# EAGLE design Brunei_Brain (EAGLE 6.5.0)
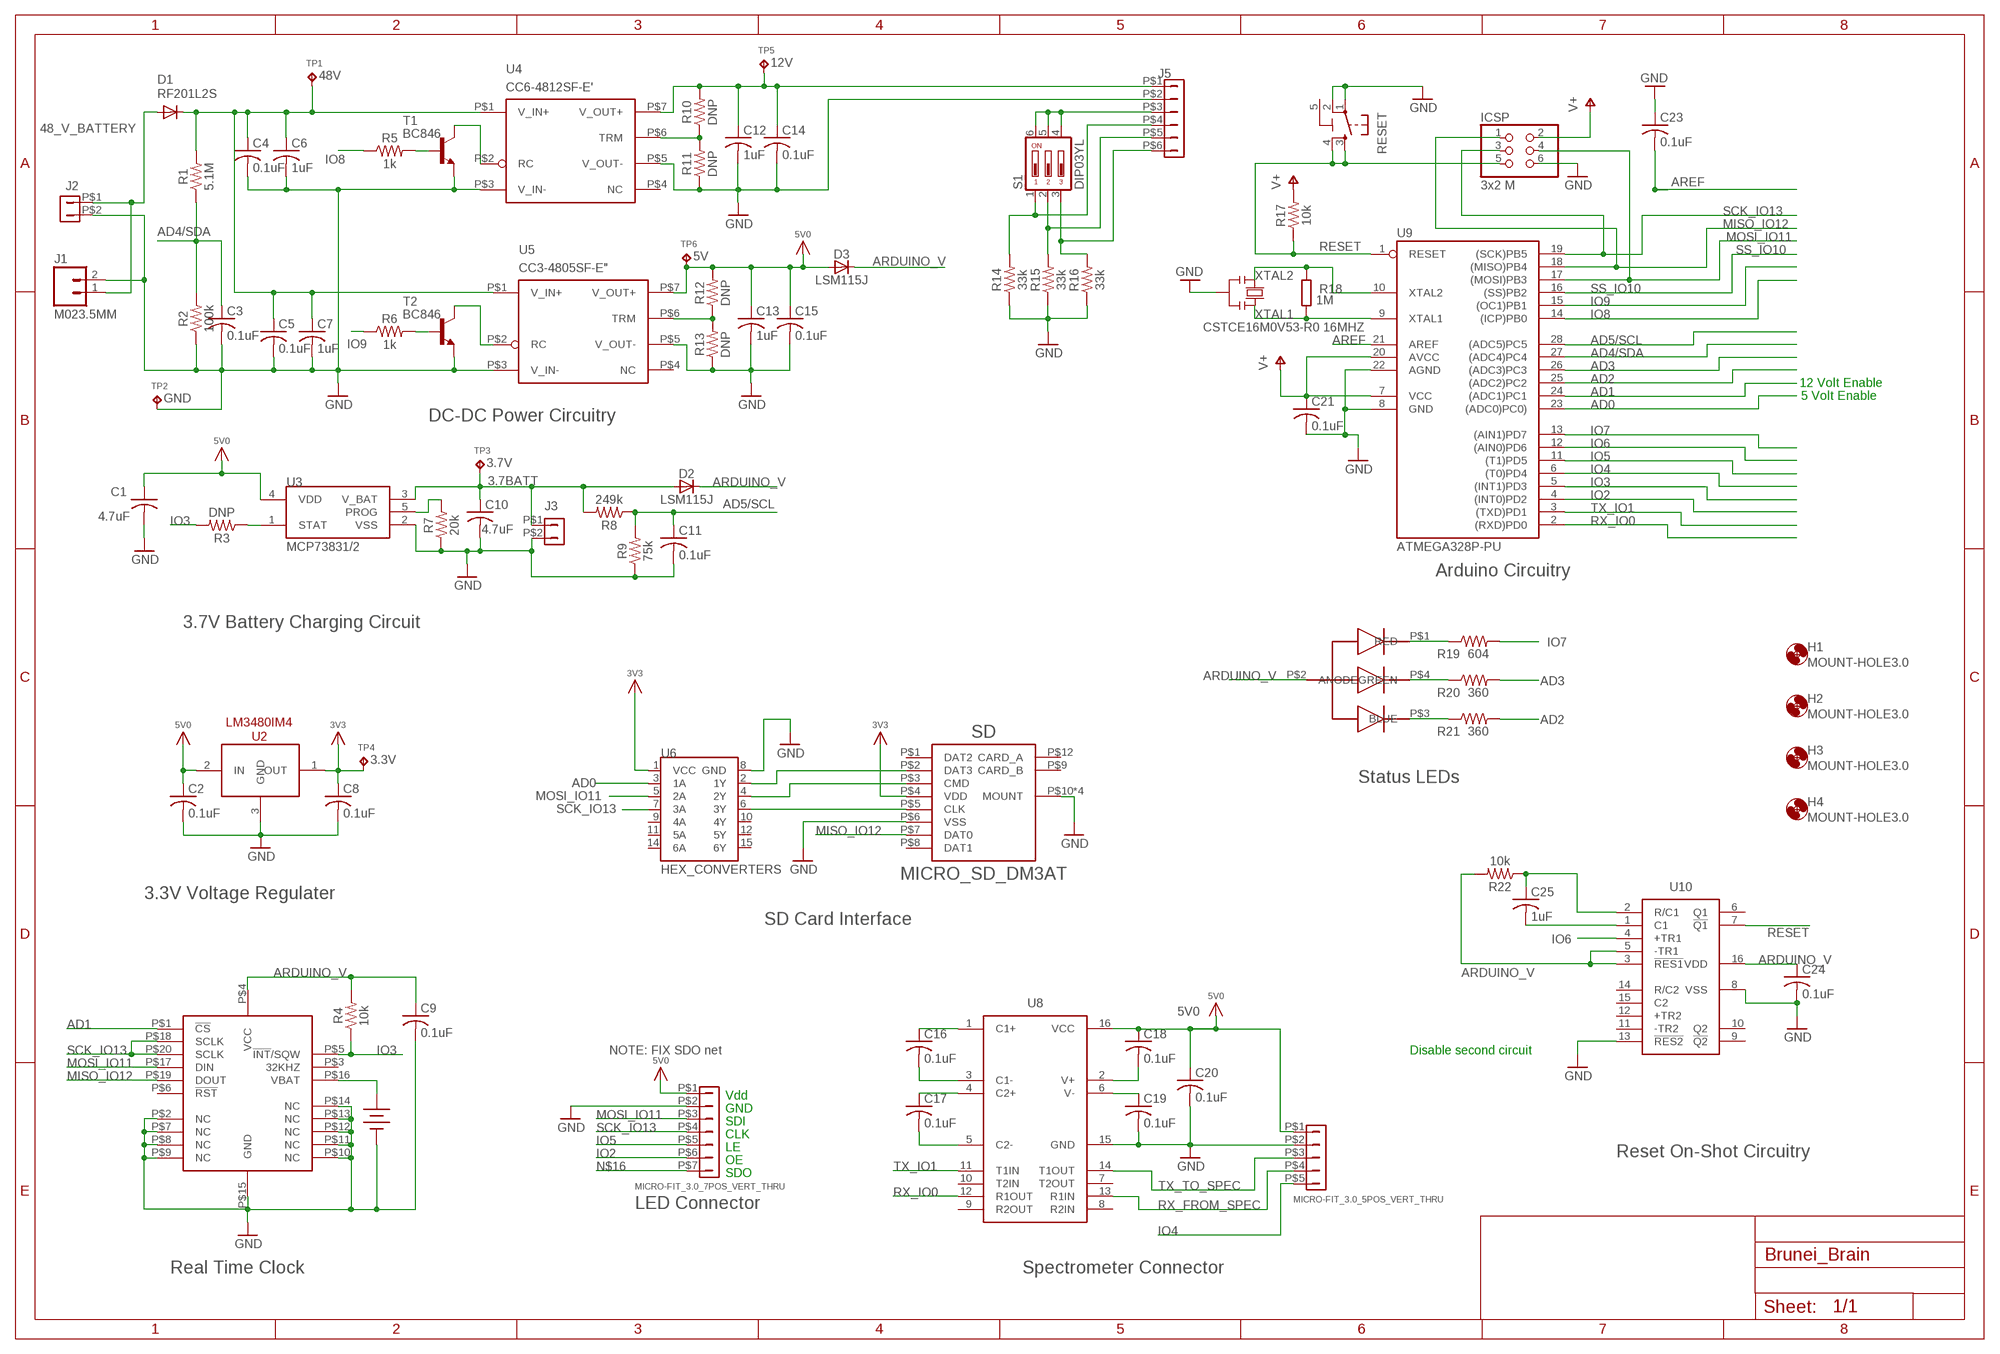
[diagram p0: schematic, sheet 1]

## Parts
B1  BATTERY_12MM  [KEYSTONE_12MM_BATT_SM]
C1  4.7uF  C-USC0603  [C0603]
C2  0.1uF  C-USC0603  [C0603]
C3  0.1uF  C-USC0603  [C0603]
C4  0.1uF  C-USC0603  [C0603]
C5  0.1uF  C-USC0603  [C0603]
C6  1uF  C-USC1206  [C1206]
C7  1uF  C-USC1206  [C1206]
C8  0.1uF  C-USC0603  [C0603]
C9  0.1uF  C-USC0603  [C0603]
C10  4.7uF  C-USC0603  [C0603]
C11  0.1uF  C-USC0603  [C0603]
C12  1uF  C-USC1206  [C1206]
C13  1uF  C-USC1206  [C1206]
C14  0.1uF  C-USC0603  [C0603]
C15  0.1uF  C-USC0603  [C0603]
C16  0.1uF  C-USC0603  [C0603]
C17  0.1uF  C-USC0603  [C0603]
C18  0.1uF  C-USC0603  [C0603]
C19  0.1uF  C-USC0603  [C0603]
C20  0.1uF  C-USC0603  [C0603]
C21  0.1uF  C-USC0603  [C0603]
C23  0.1uF  C-USC0603  [C0603]
C24  0.1uF  C-USC0603  [C0603]
C25  1uF  C-USC1206  [C1206]
D1  RF201L2S  RF201L2SRF201L2S  [SOD-106]
D2  LSM115J  LSM115JLSM115J  [DO-214BA]
D3  LSM115J  LSM115JLSM115J  [DO-214BA]
D4  RGB_LED_COMMON_ANODE_1  [PLCC-4]
H1  MOUNT-HOLE3.0  [3,0]
H2  MOUNT-HOLE3.0  [3,0]
H3  MOUNT-HOLE3.0  [3,0]
H4  MOUNT-HOLE3.0  [3,0]
ICSP  3x2 M  PINHD-2X3  [2X03]
J1  M023.5MM  [SCREWTERMINAL-3.5MM-2]
J2  MICRO-FIT_3.0_2POS_VERT_THRU  [MICRO-FIT_3.0_2POS_VERT_THROUGH]
J3  MICRO-FIT_3.0_2POS_VERT_THRU  [MICRO-FIT_3.0_2POS_VERT_THROUGH]
J4  MICRO-FIT_3.0_7POS_VERT_THRU  [MICRO-FIT_3.0_7POS_VERT_THROUGH]
J5  MICRO-FIT_3.0_6POS_VERT_THRU  [MICRO-FIT_3.0_6POS_VERT_THROUGH]
J6  MICRO-FIT_3.0_5POS_VERT_THRU  [MICRO-FIT_3.0_5POS_VERT_THROUGH]
R1  5.1M  RESISTOR0603-RES  [0603-RES]
R2  100k  RESISTOR0603-RES  [0603-RES]
R3  DNP  RESISTOR0603-RES  [0603-RES]
R4  10k  RESISTOR0603-RES  [0603-RES]
R5  1k  RESISTOR0603-RES  [0603-RES]
R6  1k  RESISTOR0603-RES  [0603-RES]
R7  20k  RESISTOR0603-RES  [0603-RES]
R8  249k  RESISTOR0603-RES  [0603-RES]
R9  75k  RESISTOR0603-RES  [0603-RES]
R10  DNP  RESISTOR0603-RES  [0603-RES]
R11  DNP  RESISTOR0603-RES  [0603-RES]
R12  DNP  RESISTOR0603-RES  [0603-RES]
R13  DNP  RESISTOR0603-RES  [0603-RES]
R14  33k  RESISTOR0603-RES  [0603-RES]
R15  33k  RESISTOR0603-RES  [0603-RES]
R16  33k  RESISTOR0603-RES  [0603-RES]
R17  10k  RESISTOR0603-RES  [0603-RES]
R18  1M  R-EU_R0603  [R0603-ROUND]
R19  604  RESISTOR0603-RES  [0603-RES]
R20  360  RESISTOR0603-RES  [0603-RES]
R21  360  RESISTOR0603-RES  [0603-RES]
R22  10k  RESISTOR0603-RES  [0603-RES]
RESET  TS42031-160R-TR-7260  TS42  [TS42]
S1  DIP03YL  [DIP03YL]
SD  MICRO_SD_DM3AT  [MICROSD_DM3AT]
T1  BC846  [SOT23]
T2  BC846  [SOT23]
TP1  TPPAD1-13  [P1-13]
TP2  TPPAD1-13  [P1-13]
TP3  TPPAD1-13  [P1-13]
TP4  TPPAD1-13  [P1-13]
TP5  TPPAD1-13  [P1-13]
TP6  TPPAD1-13  [P1-13]
U1  DS3234  [SOIC-20_MAXIM]
U2  LM3480IM4  [SOT23-3]
U3  MCP73831/2  MCP73832  [SOT23-5]
U4  CC6-4812SF-E'  [CC6-XXXXXF-E]
U5  CC3-4805SF-E"  [CC3-XXXXXF-E]
U6  HEX_CONVERTERS  [SO-16_SSG]
U8  ST232  [SO-16_SSG]
U9  ATMEGA328P-PU  [DIL28-3]
U10  MULTIVIBRATOR_DUAL  [SO-16_SSG]
Y1  CSTCE16M0V53-R0 16MHZ  RESONATORMU  [RESONATOR]

## Nets
3.7BATT [power]: C10.1 D2.P$1(A) J3.P$1 R8.2 TP3.TP U3.3(V_BAT)
3V3 [power]: C8.1 SD.P$4(VDD) TP4.TP U2.1(OUT) U6.1(VCC) ; supply symbol labelled SUP_3V3
5V0: C1.1 C2.1 C13.1 C15.1 C18.1 C20.1 D3.P$1(A) J4.P$1 J6.P$1 R12.2 TP6.TP U2.2(IN) U3.4(VDD) U5.P$7(V_OUT+) U8.16(VCC) ; supply symbol labelled SUP_5V0
12V [power]: C12.1 C14.1 J5.P$1 R10.2 TP5.TP U4.P$7(V_OUT+)
48_V_BATTERY [power]: D1.P$1(A) J1.1 J2.P$1
48V [power]: C4.1 C5.1 C6.1 C7.1 D1.P$2(C) R1.2 TP1.TP U4.P$1(V_IN+) U5.P$1(V_IN+)
AD0: U6.3(1A) U9.23((ADC0)PC0))
AD1: U1.P$1(!CS) U9.24((ADC1)PC1)
AD2: R21.2 U9.25((ADC2)PC2)
AD3: R20.2 U9.26((ADC3)PC3)
AD4/SDA: C3.1 R1.1 R2.2 U9.27((ADC4)PC4)
AD5/SCL: C11.1 R8.1 R9.2 U9.28((ADC5)PC5)
ARDUINO_V [usbvcc]: C9.1 C21.1 C24.1 D2.P$2(C) D3.P$2(C) D4.P$2(ANODE) ICSP.2 R4.2 R17.2 R22.2 U1.P$4(VCC) U9.7(VCC) U9.20(AVCC) U10.3(!RES1) U10.5(-TR1) U10.16(VDD) ; supply symbol labelled V+
AREF [aref]: C23.2 U9.21(AREF)
DEUTERIUM_ENABLE: J5.P$4 R14.2 S1.1
GND [gnd]: B1.P$3(V-) C1.2 C2.2 C3.2 C4.2 C5.2 C6.2 C7.2 C8.2 C9.2 C10.2 C11.2 C12.2 C13.2 C14.2 C15.2 C19.2 C20.2 C21.2 C23.1 C24.2 ICSP.6 J1.2 J2.P$2 J3.P$2 J4.P$2 J5.P$2 J6.P$2 R2.1 R7.1 R9.1 R11.1 R13.1 R14.1 R15.1 R16.1 RESET.1 RESET.2 SD.P$6(VSS) SD.P$10(MOUNT) SD.P$11(MOUNT) SD.P$13(MOUNT) SD.P$14(MOUNT) T1.2(E) T2.2(E) TP2.TP U1.P$2(NC) U1.P$7(NC) U1.P$8(NC) U1.P$9(NC) U1.P$10(NC) U1.P$11(NC) U1.P$12(NC) U1.P$13(NC) U1.P$14(NC) U1.P$15(GND) U2.3(GND) U3.2(VSS) U4.P$3(V_IN-) U4.P$5(V_OUT-) U5.P$3(V_IN-) U5.P$5(V_OUT-) U6.8(GND) U8.15(GND) U9.8(GND) U9.22(AGND) U10.8(VSS) U10.13(!RES2) Y1.2
IO2: J4.P$6 U9.4((INT0)PD2)
IO3 [data]: R3.2 R4.1 U1.P$5(!INT!/SQW) U9.5((INT1)PD3)
IO4 [data]: J6.P$5 U9.6((T0)PD4)
IO5 [data]: J4.P$5 U9.11((T1)PD5)
IO6: U9.12((AIN0)PD6) U10.4(+TR1)
IO7: R19.2 U9.13((AIN1)PD7)
IO8: R5.1 U9.14((ICP)PB0)
IO9: R6.1 U9.15((OC1)PB1)
LAMP_5V: J5.P$3 S1.4 S1.5 S1.6
MISO_IO12: ICSP.1 SD.P$7(DAT0) U1.P$19(DOUT) U9.18((MISO)PB4)
MOSI_IO11 [data]: ICSP.4 J4.P$3 U1.P$17(DIN) U6.5(2A) U9.17((MOSI)PB3)
N$1: T2.3(C) U5.P$2(RC)
N$2: T1.3(C) U4.P$2(RC)
N$3: R5.2 T1.1(B)
N$4: R6.2 T2.1(B)
N$5: R12.1 R13.2 U5.P$6(TRM)
N$6: B1.P$1(V+) B1.P$2(V+) U1.P$16(VBAT)
N$7: R7.2 U3.5(PROG)
N$8: SD.P$3(CMD) U6.4(2Y)
N$9: SD.P$5(CLK) U6.6(3Y)
N$10: R3.1 U3.1(STAT)
N$13: C25.2 U10.1(C1)
N$14: C25.1 R22.1 U10.2(R/C1)
N$15: D4.P$1(RED) R19.1
N$16: J4.P$7
N$17: D4.P$4(GREEN) R20.1
N$18: D4.P$3(BLUE) R21.1
N$19: C16.1 U8.1(C1+)
N$20: R10.1 R11.2 U4.P$6(TRM)
N$21: C16.2 U8.3(C1-)
N$22: C17.1 U8.4(C2+)
N$23: C17.2 U8.5(C2-)
N$24: C19.1 U8.6(V-)
N$26: C18.2 U8.2(V+)
N$163: SD.P$2(DAT3) U6.2(1Y)
RESET: ICSP.5 R17.1 RESET.3 RESET.4 U9.1(RESET) U10.7(!Q1)
RX_FROM_SPEC: J6.P$4 U8.13(R1IN)
RX_IO0: U8.12(R1OUT) U9.2((RXD)PD0)
SCK_IO13 [data]: ICSP.3 J4.P$4 U1.P$18(SCLK) U1.P$20(SCLK) U6.7(3A) U9.19((SCK)PB5)
SHUTTER_ENABLE: J5.P$6 R16.2 S1.3
SS_IO10: U9.16((SS)PB2)
TUNGSTEN_ENABLE: J5.P$5 R15.2 S1.2
TX_IO1: U8.11(T1IN) U9.3((TXD)PD1)
TX_TO_SPEC: J6.P$3 U8.14(T1OUT)
XTAL1: R18.1 U9.9(XTAL1) Y1.3
XTAL2: R18.2 U9.10(XTAL2) Y1.1
Unconnected: SD.P$1(DAT2) SD.P$8(DAT1) SD.P$9(CARD_B) SD.P$12(CARD_A) U1.P$3(32KHZ) U1.P$6(!RST) U4.P$4(NC) U5.P$4(NC) U6.9(4A) U6.10(4Y) U6.11(5A) U6.12(5Y) U6.14(6A) U6.15(6Y) U8.7(T2OUT) U8.8(R2IN) U8.9(R2OUT) U8.10(T2IN) U10.6(Q1) U10.9(!Q2) U10.10(Q2) U10.11(-TR2) U10.12(+TR2) U10.14(R/C2) U10.15(C2)

## Notes on the sheet
- 12 Volt Enable
- 5 Volt Enable
- DC-DC Power Circuitry
- Arduino Circuitry
- 3.7V Battery Charging Circuit
- Status LEDs
- 3.3V Voltage Regulater
- SD Card Interface
- NOTE: FIX SDO net | Disable second circuit
- Vdd
- GND
- SDI
- CLK
- LE
- Reset On-Shot Circuitry
- OE
- SDO
- LED Connector
- Real Time Clock | Spectrometer Connector

## Power pins joined to a net without a drawn wire
5-GND: RESET.5(5-GND)

## Library data of the parts
B1 = Schuyler:BATTERY: Battery holder for 12mm coin cell.; MANPARTNUMBER: 3000TR; MANUFACTURER: Keystone Electronics; PARTNUMBER: 3000KCT-ND; SUPPLIER: DIGIKEY; VERIFIED: FALSE
C1 C10 = resistor:C-US: CAPACITOR, American symbol; PARTNUMBER: 445-5178-1-ND; SUPPLIER: DIGIKEY
C2 C8 C9 C16-C21 C23 C24 = resistor:C-US: CAPACITOR, American symbol; PARTNUMBER: 311-1523-1-ND
C3-C5 C11 C14 C15 = rcl:C-US: CAPACITOR, American symbol; PARTNUMBER: 311-1523-1-ND
C6 C7 C12 C13 C25 = rcl:C-US: CAPACITOR, American symbol; PARTNUMBER: 1276-2747-1-ND; SUPPLIER: DIGIKEY
D1 = Schuyler:RF201L2S: Diode. ROHM RF201L2S. Digikey=RF201L2STE25CT-ND.; MANPARTNUMBER: RF201L2STE25; MANUFACTURER: Rohm Semiconductor; PARTNUMBER: RF201L2STE25CT-ND; SUPPLIER: DIGIKEY; VERIFIED: TRUE
D2 D3 = Schuyler:LSM115J: Schottky Diode 1A 15V. http://www2.microsemi.com/datasheets/msc1300.pdf; MANPARTNUMBER: LSM115JE3/TR13; MANUFACTURER: Microsemi Commercial Components Group; PARTNUMBER: LSM115JE3/TR13CT-ND; SUPPLIER: DIGIKEY; VERIFIED: TRUE
D4 = Schuyler:RGB_LED_COMMON_ANODE: RGB LED with a common anode connection.; MANPARTNUMBER: CLV1A-FKB-CJ1M1F1BB7R4S3; MANUFACTURER: Cree Inc; PARTNUMBER: CLV1A-FKB-CJ1M1F1BB7R4S3CT-ND; SUPPLIER: DIGIKEY; VERIFIED: FALSE
H1-H4 = holes:MOUNT-HOLE: MOUNTING HOLE with drill center marker
ICSP = SmartPrj:PINHD-2X3: PIN HEADER
J1 = SparkFun-Connectors:M02: Standard 2-pin 0.1" header. Use with - straight break away headers ( PRT-00116) - right angle break away headers (PRT-00553) - swiss pins (PRT-00743) - machine pins (PRT-00117) - female headers (PRT-00115) Molex polarized connector foot print use with: PRT-08233 with associated crimp pins and housings. 2.54_SCREWTERM for use with PRT-10571. 3.5mm Screw Terminal footprints for PRT-08084 5mm Screw Terminal footprints for use with PRT-08433; MANPARTNUMBER: 1984617; MANUFACTURER: Phoenix Contact; PARTNUMBER: 277-1721-ND; SUPPLIER: DIGIKEY
J2 J3 = Schuyler:MICRO-FIT_3.0_2POS_; MANPARTNUMBER: 0436500215; MANUFACTURER: Molex Inc; PARTNUMBER: WM1917-ND; SUPPLIER: DIGIKEY; VERIFIED: TRUE
J4 = Schuyler:MICRO-FIT_3.0_7POS_; MANPARTNUMBER: 0436500715; MANUFACTURER: Molex Inc; PARTNUMBER: WM2471-ND; SUPPLIER: DIGIKEY; VERIFIED: TRUE
J5 = Schuyler:MICRO-FIT_3.0_6POS_; MANPARTNUMBER: 0436500615; MANUFACTURER: Molex Inc; PARTNUMBER: WM1921-ND; SUPPLIER: DIGIKEY; VERIFIED: TRUE
J6 = Schuyler:MICRO-FIT_3.0_5POS; MANPARTNUMBER: 0436500515; MANUFACTURER: Molex Inc; PARTNUMBER: WM1920-ND; SUPPLIER: DIGIKEY; VERIFIED: TRUE
R1 = SparkFun-Passives:RESISTOR: Resistor Basic schematic elements and footprints for 0603, 1206, and PTH resistors.; PARTNUMBER: 541-5.10MHCT-ND; SUPPLIER: DIGIKEY
R2 = SparkFun-Passives:RESISTOR: Resistor Basic schematic elements and footprints for 0603, 1206, and PTH resistors.; PARTNUMBER: 1276-3486-1-ND; SUPPLIER: DIGIKEY
R3 R10-R13 = SparkFun-Passives:RESISTOR: Resistor Basic schematic elements and footprints for 0603, 1206, and PTH resistors.
R4 R17 R22 = SparkFun-Passives:RESISTOR: Resistor Basic schematic elements and footprints for 0603, 1206, and PTH resistors.; PARTNUMBER: 311-10.0KHRCT-ND; SUPPLIER: DIGIKEY
R5 R6 = SparkFun-Passives:RESISTOR: Resistor Basic schematic elements and footprints for 0603, 1206, and PTH resistors.; PARTNUMBER: 1276-5062-1-ND; SUPPLIER: DIGIKEY
R7 = SparkFun-Passives:RESISTOR: Resistor Basic schematic elements and footprints for 0603, 1206, and PTH resistors.; PARTNUMBER: 1276-4768-1-ND; SUPPLIER: DIGIKEY
R8 = SparkFun-Passives:RESISTOR: Resistor Basic schematic elements and footprints for 0603, 1206, and PTH resistors.; PARTNUMBER: 311-249KHRCT-ND; SUPPLIER: DIGIKEY
R9 = SparkFun-Passives:RESISTOR: Resistor Basic schematic elements and footprints for 0603, 1206, and PTH resistors.; PARTNUMBER: 311-75.0KHRCT-ND; SUPPLIER: DIGIKEY
R14-R16 = SparkFun-Passives:RESISTOR: Resistor Basic schematic elements and footprints for 0603, 1206, and PTH resistors.; PARTNUMBER: 311-33KGRCT-ND; SUPPLIER: DIGIKEY
R18 = SmartPrj:R-EU_: RESISTOR, European symbol; PARTNUMBER: P1.00MHCT-ND; SUPPLIER: DIGIKEY
R19 = SparkFun-Passives:RESISTOR: Resistor Basic schematic elements and footprints for 0603, 1206, and PTH resistors.; PARTNUMBER: 1276-3506-1-ND; SUPPLIER: DIGIKEY
R20 R21 = SparkFun-Passives:RESISTOR: Resistor Basic schematic elements and footprints for 0603, 1206, and PTH resistors.; PARTNUMBER: 1276-5051-1-ND; SUPPLIER: DIGIKEY
RESET = SmartPrj:TS42: TS42 Dongnan Electronics Tact switch VDC 12V - 50mA; PARTNUMBER: 450-1759-1-ND; SUPPLIER: DIGIKEY
S1 = switch-dil:DIP03YL: DIL/CODE SWITCH; MANPARTNUMBER: 209-3MS; MANUFACTURER: CTS Electrocomponents; PARTNUMBER: CT2093MS-ND; SUPPLIER: DIGIKEY; VERIFIED: TRUE
SD = Schuyler:MICRO_SD_DM3AT: Micro SD Card holder. Push/Push.; MANPARTNUMBER: DM3AT-SF-PEJM5; MANUFACTURER: Hirose Electric Co Ltd; PARTNUMBER: HR1964CT-ND; SUPPLIER: DIGIKEY
T1 T2 = transistor:BC846: NPN TRANSISTOR; PARTNUMBER: MMBT2484LT1GOSCT-ND; SUPPLIER: DIGIKEY
TP1 = testpad:TP: Test pad; TP_SIGNAL_NAME: 48V
TP2 = testpad:TP: Test pad; TP_SIGNAL_NAME: GND
TP3 = testpad:TP: Test pad; TP_SIGNAL_NAME: 3.7V
TP4 = testpad:TP: Test pad; TP_SIGNAL_NAME: 3.3V
TP5 = testpad:TP: Test pad; TP_SIGNAL_NAME: 12V
TP6 = testpad:TP: Test pad; TP_SIGNAL_NAME: 5V
U1 = Schuyler:DS3234: Real Time Clock. http://datasheets.maximintegrated.com/en/ds/DS3234.pdf; MANPARTNUMBER: DS3234S#; MANUFACTURER: Maxim Integrated; PARTNUMBER: DS3234S#-ND; SUPPLIER: DIGIKEY; VERIFIED: FALSE
U2 = SparkFun-PowerIC:LM3480IM4: Small package linear regulator; PARTNUMBER: LM3480IM3-3.3CT-ND; SUPPLIER: DIGIKEY; VERIFIED: TRUE
U3 = Schuyler:MCP7383: Lithium Polymer batter charger. http://www.sparkfun.com/datasheets/Prototyping/Batteries/MCP73831T.pdf; MANPARTNUMBER: MCP73832T-2ACI/OT; MANUFACTURER: Microchip Technology; PARTNUMBER: MCP73832T-2ACI/OTCT-ND; SUPPLIER: DIGIKEY; VERIFIED: TRUE
U4 = Schuyler:CC6-4812SF-E: TDK-Lamda DC-DC Converter Vin = 48V, Vout = 12V, Power = 6W.; MANPARTNUMBER: CC6-4812SF-E; MANUFACTURER: TDK-Lamda Americas Inc; PARTNUMBER: 445-3288-ND; SUPPLIER: DIGIKEY; VERIFIED: TRUE
U5 = Schuyler:CC3-4805SF-E: TDK-Lamda DC-DC Converter. In=48V, Out=5V, Power=3W.; MANPARTNUMBER: CC3-4805SF-E; MANUFACTURER: TDK-Lambda Americas Inc; PARTNUMBER: 445-3276-ND; SUPPLIER: DIGIKEY; VERIFIED: TRUE
U6 = Schuyler:HEX_CONVERTER: Just what it says.; PARTNUMBER: 568-1453-5-ND; SUPPLIER: DIGIKEY
U8 = Schuyler:ST232: RS232 to CMOS/TTL dual transceiver.; MANPARTNUMBER: ST232CDR; MANUFACTURER: STMicroelectronics; PARTNUMBER: 497-6529-1-ND; SUPPLIER: DIGIKEY
U9 = SmartPrj:ATMEGA328P-: MICROCONTROLLER 4 Kbytes FLASH 128 bytes SRAM 256 bytes EEPROM UART 6-channel 10 bit ADC; PARTNUMBER: ATMEGA328P-PN-ND; SUPPLIER: DIGIKEY
U10 = Schuyler:MULTIVIBRATOR_DUAL: Dual monostable multivibrator. Standard 4098 chip.; MANPARTNUMBER: CD4098BM; MANUFACTURER: Texas Instruments; PARTNUMBER: 296-16736-5-ND; SUPPLIER: DIGIKEY; VERIFIED: FALSE
Y1 = SmartPrj:RESONATOR; PARTNUMBER: 490-1198-1-ND; SUPPLIER: DIGIKEY

## Net classes
0 default: width 0.203 mm, drill 0.381 mm, clearance 0.254 mm
1 power: width 0.203 mm, drill 0.381 mm, clearance 0.254 mm
2 gnd: width 0.203 mm, drill 0.381 mm, clearance 0.254 mm
3 usbvcc: width 0.203 mm, drill 0.381 mm, clearance 0.254 mm
4 aref: width 0.203 mm, drill 0.381 mm, clearance 0.254 mm
5 data: width 0.203 mm, drill 0.381 mm, clearance 0.254 mm

## Board
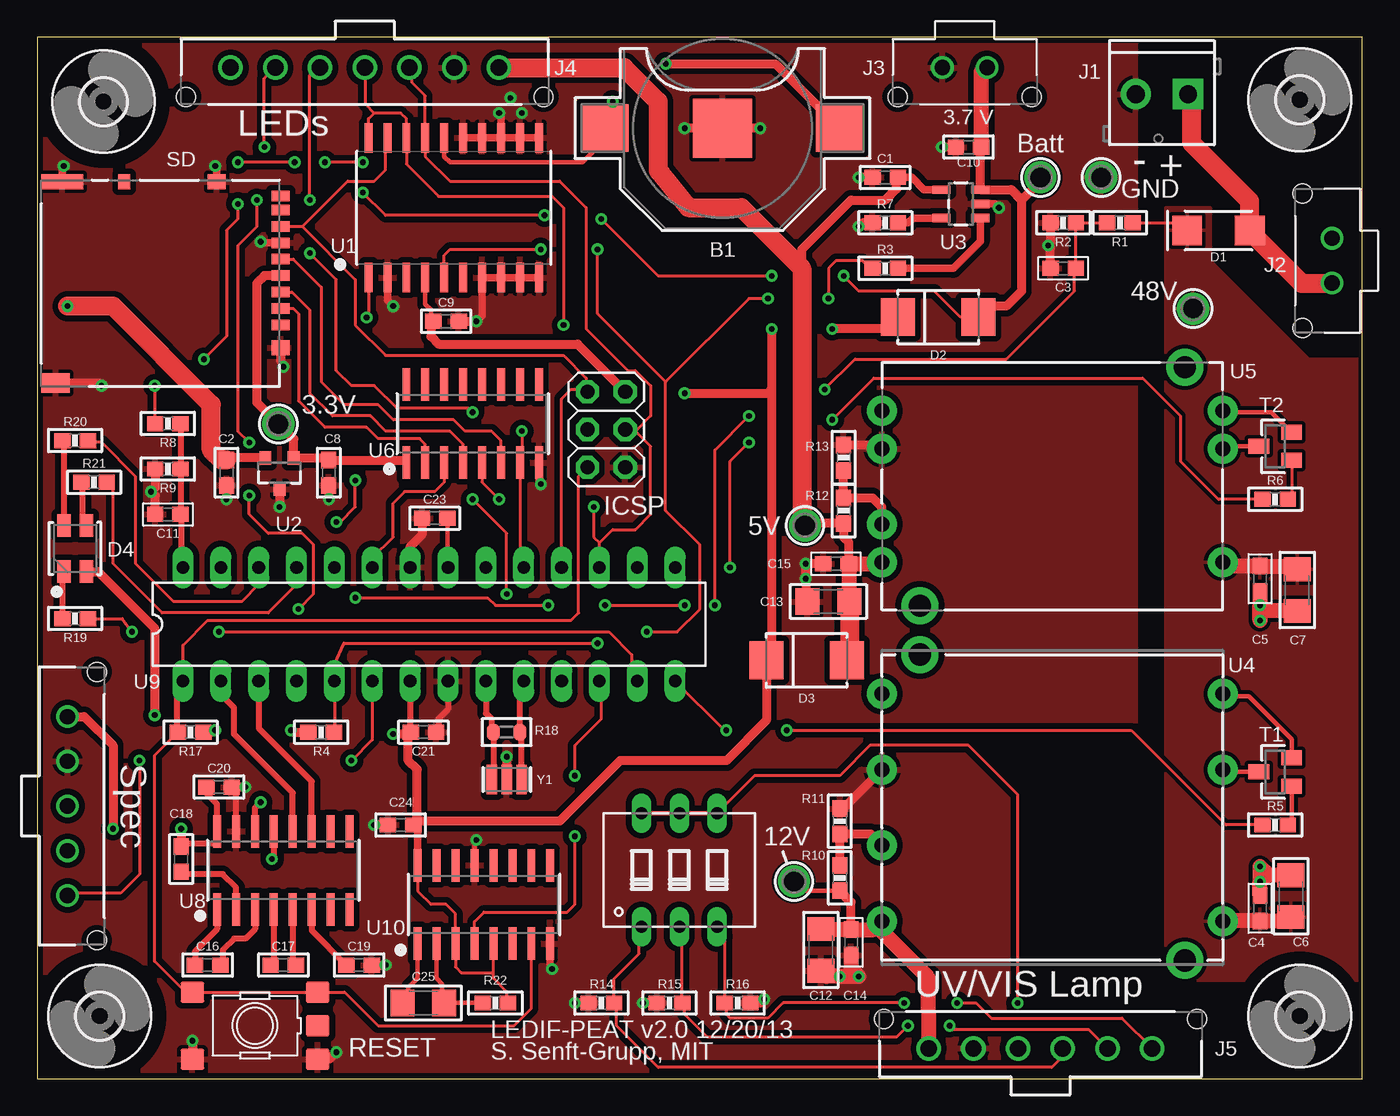
[diagram p1: board, top side]
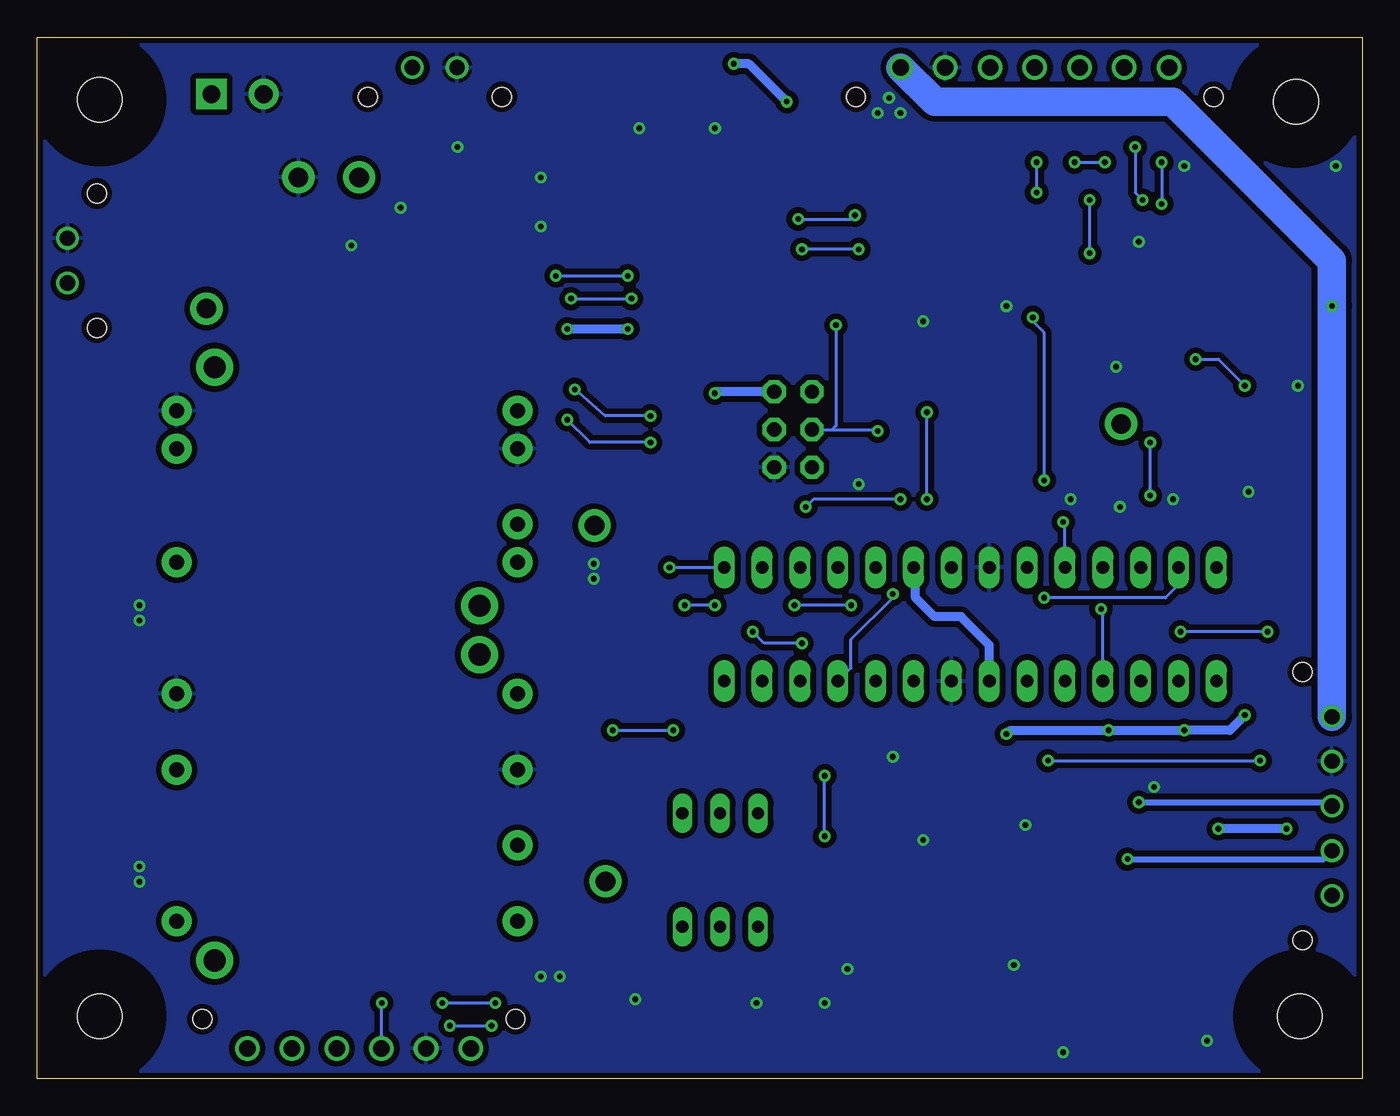
[diagram p2: board, bottom side, seen from below]

Size 88.9 x 69.85 mm. Coordinates in mm from the lower left corner, seen from the top.
Outline: 0,0 88.9,0 88.9,69.85 0,69.85 0,0
Copper layers (1*16): Top 0.035mm / dielectric 1.5mm / Bottom 0.035mm
Design rules "default *": minimum track width 6mil, minimum drill 15mil, track to track 6mil, track to pad 6mil, pad to pad 6mil, via to via 8mil, smd to smd 0mil, copper to edge 10mil, drill to drill 15mil, minimum pad ring 10mil, minimum via ring 8mil, stop-mask expansion 4mil, vias tented up to drill 0mil, thermal gap 10mil

### Footprints (pad centres in the part's own frame; a part is rotated, then mirrored left to right if it is on the bottom)
KEYSTONE_12MM_BATT_SM = smd 3.175 x 3.175: P$1 -7.874,0; P$2 7.874,0 | smd 3.962 x 3.962: P$3 0,0
C0603 = smd 1.1 x 1: 1 -0.85,0; 2 0.85,0
C1206 = smd 1.6 x 1.8: 1 -1.4,0; 2 1.4,0
SOD-106 = smd 2 x 2: P$1 0,-2.1; P$2 0,2.1
DO-214BA = smd 2.286 x 2.54: P$1 -2.699,0; P$2 2.699,0
PLCC-4 = smd 1.5 x 0.9: P$1 -1.55,0.75; P$2 -1.55,-0.75; P$3 1.55,-0.75; P$4 1.55,0.75
3,0 = hole 3: 0,0
2X03 = drill 0.95 pad 1.55 octagon: 1 -2.54,-1.27; 2 -2.54,1.27; 3 0,-1.27; 4 0,1.27; 5 2.54,-1.27; 6 2.54,1.27
SCREWTERMINAL-3.5MM-2 = drill 1.2 pad 2.032 square: 1 0,0 | drill 1.2 pad 2.032: 2 3.5,0
MICRO-FIT_3.0_2POS_VERT_THROUGH = drill 1.016: P$1 1.5,0; P$2 -1.5,0 | hole 1.27: 4.5,-1.96; -4.5,-1.96
MICRO-FIT_3.0_7POS_VERT_THROUGH = drill 1.1: P$1 9,0; P$2 6,0; P$3 3,0; P$4 0,0; P$5 -3,0; P$6 -6,0; P$7 -9,0 | hole 1.27: 12,-1.96; -12,-1.96
MICRO-FIT_3.0_6POS_VERT_THROUGH = drill 1.1: P$1 7.5,0; P$2 4.5,0; P$3 1.5,0; P$4 -1.5,0; P$5 -4.5,0; P$6 -7.5,0 | hole 1.27: 10.5,-1.96; -10.5,-1.96
MICRO-FIT_3.0_5POS_VERT_THROUGH = drill 1.016: P$1 6,0; P$2 3,0; P$3 0,0; P$4 -3,0; P$5 -6,0 | hole 1.27: 9,-1.96; -9,-1.96
0603-RES = smd 1.1 x 1: 1 -0.85,0; 2 0.85,0
R0603-ROUND = smd 0.898 x 1.1: 1 -0.889,0; 2 0.889,0
TS42 = smd 1.6 x 1.4: 1 -4.2,2.25; 2 4.2,2.25; 3 -4.2,-2.25; 4 4.2,-2.25; 5 -4.2,0
DIP03YL = drill 0.813 long: 1 -2.54,-3.81; 2 0,-3.81; 3 2.54,-3.81; 4 2.54,3.81; 5 0,3.81; 6 -2.54,3.81
MICROSD_DM3AT = smd 0.7 x 1.2: P$1 2.775,8.075; P$2 1.675,8.075; P$3 0.575,8.075; P$4 -0.525,8.075; P$5 -1.625,8.075; P$6 -2.725,8.075; P$7 -3.825,8.075; P$8 -4.925,8.075; P$9 -5.875,8.075 | smd 1 x 1.2: P$10 4.325,8.075; P$11 -6.825,3.775 | smd 1 x 0.8: P$12 -6.825,-2.425 | smd 1 x 2.8: P$13 -6.825,-6.575 | smd 1.3 x 1.9: P$14 6.675,-7.025
SOT23 = smd 1 x 1.4: 1 -0.95,-1.1; 2 0.95,-1.1; 3 0,1.1
P1-13 = drill 1.321 pad 2.159: TP 0,0
SOIC-20_MAXIM = smd 1.98 x 0.53: P$1 -4.685,5.715; P$2 -4.685,4.445; P$3 -4.685,3.175; P$4 -4.685,1.905; P$5 -4.685,0.635; P$6 -4.685,-0.635; P$7 -4.685,-1.905; P$8 -4.685,-3.175; P$9 -4.685,-4.445; P$10 -4.685,-5.715; P$11 4.685,-5.715; P$12 4.685,-4.445; P$13 4.685,-3.175; P$14 4.685,-1.905; P$15 4.685,-0.635; P$16 4.685,0.635; P$17 4.685,1.905; P$18 4.685,3.175; P$19 4.685,4.445; P$20 4.685,5.715
SOT23-3 = smd 0.8 x 0.9: 1 -0.95,-1; 2 0.95,-1; 3 0,1.1
SOT23-5 = smd 0.55 x 1.2: 1 -0.95,-1.3; 2 0,-1.3; 3 0.95,-1.3; 4 0.95,1.3; 5 -0.95,1.3
CC6-XXXXXF-E = drill 1 pad 2: P$1 0,-2.63; P$2 0,-12.79; P$3 0,-17.87; P$4 22.86,-17.87; P$5 22.86,-12.79; P$6 22.86,-7.71; P$7 22.86,-2.63 | drill 1.5 pad 2.5: P$8 2.54,0; P$9 20.32,-20.5
CC3-XXXXXF-E = drill 1 pad 2: P$1 0,-2.92; P$2 0,-10.54; P$3 0,-13.08; P$4 22.86,-13.08; P$5 22.86,-10.54; P$6 22.86,-5.46; P$7 22.86,-2.92 | drill 1.5 pad 2.5: P$8 20.32,0; P$9 2.54,-16
SO-16_SSG = smd 2.184 x 0.533: 1 -2.616,4.445; 2 -2.616,3.175; 3 -2.616,1.905; 4 -2.616,0.635; 5 -2.616,-0.635; 6 -2.616,-1.905; 7 -2.616,-3.175; 8 -2.616,-4.445; 9 2.616,-4.445; 10 2.616,-3.175; 11 2.616,-1.905; 12 2.616,-0.635; 13 2.616,0.635; 14 2.616,1.905; 15 2.616,3.175; 16 2.616,4.445
DIL28-3 = drill 0.85 pad 1.422 long: 1 -16.51,-3.81; 2 -13.97,-3.81; 3 -11.43,-3.81; 4 -8.89,-3.81; 5 -6.35,-3.81; 6 -3.81,-3.81; 7 -1.27,-3.81; 8 1.27,-3.81; 9 3.81,-3.81; 10 6.35,-3.81; 11 8.89,-3.81; 12 11.43,-3.81; 13 13.97,-3.81; 14 16.51,-3.81; 15 16.51,3.81; 16 13.97,3.81; 17 11.43,3.81; 18 8.89,3.81; 19 6.35,3.81; 20 3.81,3.81; 21 1.27,3.81; 22 -1.27,3.81; 23 -3.81,3.81; 24 -6.35,3.81; 25 -8.89,3.81; 26 -11.43,3.81; 27 -13.97,3.81; 28 -16.51,3.81
RESONATOR = smd 0.7 x 2: 1 -1,0; 2 0,0; 3 1,0

### Placement (x,y rotation side)
B1  45.97,63.75 0 top
C1  56.9,60.45 180 top
C2  12.7,40.64 270 top
C3  68.83,54.36 180 top
C4  82.04,11.43 90 top
C5  82.04,33.53 270 top
C6  84.12,12.24 90 top
C7  84.54,32.77 270 top
C8  19.56,40.64 270 top
C9  27.43,50.8 0 top
C10  62.48,62.48 180 top
C11  8.76,37.85 180 top
C12  52.58,8.64 270 top
C13  53.09,32 180 top
C14  54.61,9.14 270 top
C15  53.59,34.54 180 top
C16  11.43,7.62 0 top
C17  16.51,7.62 0 top
C18  9.65,14.73 270 top
C19  21.59,7.62 0 top
C20  12.19,19.56 0 top
C21  25.91,23.24 0 top
C23  26.67,37.59 0 top
C24  24.38,17.02 180 top
C25  25.91,5.08 180 top
D1  79.25,56.9 90 top
D2  60.45,51.09 180 top
D3  51.62,28.06 180 top
D4  2.54,35.56 90 top
H1  4.19,4.19 0 top
H2  4.45,65.53 0 top
H3  84.71,4.19 0 top
H4  84.71,65.66 0 top
ICSP  38.18,43.54 270 top
J1  77.22,66.04 180 top
J2  86.87,54.86 270 top
J3  62.23,67.82 0 top
J4  21.97,67.82 0 top
J5  67.31,2.03 180 top
J6  2.03,18.29 90 top
R1  72.64,57.4 0 top
R2  68.83,57.4 0 top
R3  56.9,54.36 180 top
R4  19.05,23.24 180 top
R5  83.06,17.02 0 top
R6  83.06,38.86 0 top
R7  56.9,57.4 0 top
R8  8.76,43.94 180 top
R9  8.76,40.89 0 top
R10  53.85,13.46 270 top
R11  53.85,17.27 270 top
R12  54.1,38.1 270 top
R13  54.1,41.66 270 top
R14  37.85,5.08 0 top
R15  42.42,5.08 0 top
R16  46.99,5.08 180 top
R17  10.29,23.24 0 top
R18  31.5,23.24 0 top
R19  2.54,30.86 0 top
R20  2.54,42.8 0 top
R21  3.81,40.01 0 top
R22  30.73,5.08 0 top
RESET  14.61,3.56 180 top
S1  43.08,14 0 top
SD  8.26,53.34 270 top
T1  83.06,20.57 90 top
T2  83.06,42.42 90 top
TP1  77.54,51.65 0 top
TP2  71.37,60.45 0 top
TP3  67.31,60.45 0 top
TP4  16.18,43.92 180 top
TP5  50.77,13.23 0 top
TP6  51.51,37.11 0 top
U1  27.94,58.42 90 top
U2  16.26,40.64 180 top
U3  61.98,58.67 90 top
U4  79.54,7.94 180 top
U5  79.54,31.72 180 top
U6  29.21,43.94 90 top
U8  16.51,13.97 90 top
U9  26.29,30.48 0 top
U10  29.97,11.68 90 top
Y1  31.5,20.07 180 top

### Tracks (layer width: path | path; a pad name or v marks a point on that pad's centre or on a via)
3.7BATT  (via drill 0.38)
  Top 0.203: D2.P$1 61.94,51.09 60.2,52.83 55.12,52.83 v54.1,53.85 | v34.04,57.91 23.37,57.91 v21.84,59.44 | v21.84,61.47 v19.3,61.47 | v17.27,61.47 v13.46,61.47 | v13.46,58.67 13.46,57.66 12.7,56.9 12.7,49.78 v11.18,48.26 | v7.87,46.48 7.87,43.98 R8.2 | v37.85,57.66 41.66,53.85 v49.28,53.85
  Top 0.508: 63.28,62.43 C10.1
  Top 0.61: 63.28,62.43 U3.3 65.34,59.62 66.04,58.93 | 66.04,58.93 66.04,52.83 65.02,51.82 63.88,51.82 D2.P$1 | TP3.TP 67.31,60.2 66.04,58.93
  Top 1.016: C10.1 63.33,67.51 63.43,67.51 J3.P$1
  Bottom 0.203: v54.1,53.85 v49.28,53.85 | v37.85,57.66 34.29,57.66 v34.04,57.91 | v21.84,59.44 v21.84,61.47 | v19.3,61.47 v17.27,61.47 | v13.46,61.47 v13.46,58.67 | v11.18,48.26 9.65,48.26 v7.87,46.48
3V3
  Top 0.508: 24.6,41.49 U6.1
  Top 0.61: 24.6,41.49 C8.1 19.41,41.64 U2.1 17.21,42.89 TP4.TP 14.73,45.37 14.73,53.34 15.26,53.87 SD.P$4
5V0  (via drill 0.38)
  Top 0.406: C20.1 11.43,19.47 11.43,19.05 12.06,18.41 U8.16 12.06,15.88 11.94,15.75 9.82,15.75 C18.1
  Top 0.508: U3.4 59.5,59.62 58.67,60.45 C1.1
  Top 0.61: C15.1 54.44,35.98 54.1,36.32 R12.2 50.89,37.25 TP6.TP | J6.P$1 3.14,24.29 5.08,22.35 v5.08,16.76 | v9.65,16.76 C18.1 | U2.2 12.85,41.64 C2.1 | 51.31,54.36 51.31,55.63 54.61,58.93 56.9,58.93 57.66,59.69 57.66,60.36 C1.1
  Top 1.016: U5.P$7 56.58,34.54 C15.1 54.44,32.05 C13.1
  Top 1.27: C13.1 54.49,28.23 D3.P$1 | 41.66,60.96 41.85,60.71 | 41.85,60.71 43.69,58.42 47.24,58.42 51.31,54.36 51.31,37.66 TP6.TP | J4.P$1 39.37,67.82 41.66,65.53 41.66,60.91 41.85,60.71 | C2.1 12.36,41.49 11.68,42.16 11.68,45.21 5.08,51.82 v2.03,51.82
  Bottom 0.61: v5.08,16.76 v9.65,16.76
  Bottom 1.905: J6.P$1 v2.03,51.82 2.03,54.86 12.7,65.53 28.68,65.53 J4.P$1
12V
  Top 0.305: R10.2 51.39,12.61 TP5.TP
  Top 0.61: C14.1 54.61,11.85 R10.2
  Top 1.016: 52.68,9.91 C12.1 52.62,9.99 C14.1 56.1,9.99 56.33,10.22 | 56.33,10.22 U4.P$7 | J5.P$1 59.79,6.76 56.33,10.22
48_V_BATTERY
  Top 1.27: J1.1 77.47,65.79 77.47,62.74 81.35,58.86 D1.P$1 81.35,56.83 84.84,53.34 86.99,53.34 J2.P$1
48V
  Top 0.203: R1.2 76.64,57.4 D1.P$2
  Top 1.016: U5.P$1 79.8,34.38 C5.1 84.33,34.38 C7.1 | U4.P$1 C4.1 83.85,10.58 C6.1
  pour Top (isolate 0.254): 75.69,58.42 75.69,6.6 88.9,6.6 88.9,48.26 85.34,48.26 78.74,54.86 78.74,58.42
AD0
  Top 0.203: U9.23 22.48,34.92 23.88,36.32 23.88,38.61 24.64,39.37 26.67,39.37 27.3,40.01 U6.3
AD1  (via drill 0.38)
  Top 0.203: v20.07,37.34 20.32,37.34 21.34,38.35 v21.34,40.13 | U1.P$1 22.23,51.18 v22.1,51.05
  Bottom 0.203: U9.24 19.94,37.21 v20.07,37.34 | v21.34,40.13 21.34,50.04 22.1,50.8 v22.1,51.05
AD2
  Top 0.203: U9.25 17.4,33.15 15.49,31.24 8.38,31.24 5.08,34.54 5.08,39.84 R21.2
AD3
  Top 0.203: U9.26 14.86,33.15 13.72,32 9.14,32 6.6,34.54 6.6,40.39 4.32,42.67 3.52,42.67 R20.2
AD4/SDA  (via drill 0.38)
  Top 0.203: v38.1,31.75 v43.43,31.75 | R1.1 R2.2 C3.1 69.6,54.27 69.6,52.83 65.02,48.26 54.86,48.26 v52.83,46.23 | v21.34,32.26 30.23,32.26 30.73,31.75 v34.29,31.75 | v45.47,31.75 45.47,42.16 v47.75,44.45
  Bottom 0.203: U9.27 12.32,33.15 13.21,32.26 v21.34,32.26 | v34.29,31.75 v38.1,31.75 | v43.43,31.75 v45.47,31.75 | v47.75,44.45 50.8,44.45 v52.83,46.23
AD5/SCL
  Top 0.406: R8.1 R9.2 C11.1 9.65,37.72 9.65,35.31 9.78,35.31 U9.28
ARDUINO_V  (via drill 0.38)
  Top 0.203: R22.2 31.5,5.17 31.5,5.84 30.61,6.73 30.61,7.11 | 30.61,7.11 U10.5 | U10.16 25.53,12.57 26.42,11.68 27.43,11.68 28.07,11.05 U10.3 28.07,7.49 28.45,7.11 30.61,7.11
  Top 0.305: U1.P$4 26.04,51.94 26.42,51.56 26.42,50.97 C9.1
  Top 0.406: U9.7 25.02,23.28 C21.1
  Top 0.508: U10.16 25.53,16.73 C24.1 25.49,17.27
  Top 0.61: 24.89,23.07 24.89,21.34 25.49,20.74 25.49,17.27 35.05,17.27 39.12,21.34 46.23,21.34 48.92,24.03 D3.P$2 48.92,28.6 49.28,28.96 49.28,46.23 | 24.89,23.07 C21.1 | 24.89,23.07 24.85,23.11 v23.88,23.11 | v17.02,23.37 17.14,23.24 R4.2 | v11.94,23.37 11.81,23.24 R17.2 | D4.P$2 4.09,34.01 7.87,30.23 v7.87,24.38 | D2.P$2 57.47,50.29 v53.34,50.29 | v49.28,50.29 49.28,46.23 | C9.1 26.42,50.63 26.42,49.78 26.92,49.28 36.25,49.28 ICSP.2 | v43.43,45.97 49.02,45.97 49.28,46.23
  Bottom 0.61: U9.7 25.02,29.08 26.92,30.99 28.7,30.99 29.97,32.26 29.97,34.16 U9.20 | v23.88,23.11 23.62,23.37 v17.02,23.37 v11.94,23.37 8.89,23.37 v7.87,24.38 | v53.34,50.29 v49.28,50.29 | ICSP.2 43.33,46.08 v43.43,45.97
AREF
  Top 0.305: C23.2 27.52,34.33 U9.21
DEUTERIUM_ENABLE
  Top 0.203: J5.P$4 68.79,1.48 68.07,0.76 41.66,0.76 38.86,3.56 38.86,4.91 R14.2 38.7,6.69 40.39,8.38 40.39,10.04 S1.1
GND  (via drill 0.38)
  Top 0.305: T2.2 84.14,43.37 82.8,44.7 79.64,44.7 U5.P$3 | T1.2 84.16,22.78 81.28,25.65 79.7,25.65 U4.P$3 | U10.13 29.34,15.88 v29.46,16
  Top 0.406: U8.15 13.34,19.27 C20.2 | U9.8 27.56,24.77 26.92,24.13 26.92,23.41 C21.2
  Top 0.508: v29.46,50.8 29.84,51.18 U1.P$7 U1.P$8 U1.P$9 U1.P$10 | U1.P$2 23.5,52.2 v23.88,51.82 | SD.P$6 15.05,56.06 v14.99,56.13 | SD.P$13 1.68,61.12 v1.78,61.21 | SD.P$11 12.03,61.12 v11.94,61.21 | U10.8 34.42,7.49 v34.54,7.37 | U6.8 33.66,40.01 v33.78,39.88 | U1.P$13 31.11,64.64 v30.99,64.77 | U1.P$13 U1.P$12 U1.P$11 | U1.P$13 U1.P$14 U1.P$15 | v64.52,58.42 64.26,58.67 U3.2
  Top 0.61: v43.43,63.75 B1.P$3 v48.51,63.75 | C9.2 v29.46,50.8 | R2.1 67.98,56.05 v67.82,55.88 67.98,55.71 C3.2 | C10.2 v60.71,62.48 | R9.1 7.91,39.66 v7.62,39.37 7.91,39.08 C11.2 | C2.2 v12.7,38.86 | U2.3 v16.26,38.35 | C8.2 v19.56,38.86 | U9.22 25.02,35.69 25.82,36.49 C23.1 | v31.5,21.59 Y1.2 | R14.1 v36.07,5.08 | R15.1 v40.64,5.08 | R16.1 48.51,5.08 v48.77,5.33 | R11.1 54.07,18.12 U4.P$5 | R13.1 56.43,42.51 U5.P$5 | C15.2 v51.56,34.54 | v51.56,33.53 v51.56,34.54 | v51.56,34.54 51.56,32.13 C13.2 | v13.97,19.56 C20.2 | v10.41,2.54 RESET.2 | RESET.1 19.59,1.31 v20.07,1.78 | C19.2 v23.37,7.62 | SD.P$14 4.13,46.66 v4.32,46.48 | C24.2 v22.61,17.02 | C1.2 v55.12,60.45 | R7.1 55.37,57.4 v55.12,57.15 | SD.P$10 16.33,48.19 v16.51,47.75
  Top 1.016: C6.2 82.62,13.64 v82.04,14.22 v82.04,13.21 C4.2 | C5.2 v82.04,31.75 | v82.04,30.73 v82.04,31.75 | C7.2 82.42,31.37 v82.04,31.75 | C14.2 54.61,7.37 v55.12,6.86 v53.85,6.86 52.96,6.86 C12.2
  other vias: 32.51,64.77 31.75,65.79
  pour Bottom (isolate 0.381): 0,0 0,69.85 88.9,69.85 88.9,0
  pour Top (isolate 0.381): 0,0 73.66,0 73.66,69.85 0,69.85
IO2  (via drill 0.38)
  Top 0.203: v17.53,31.5 18.54,32.51 18.54,35.81 17.78,36.58 15.49,36.58 14.22,37.85 v14.22,39.12 | v15.24,62.48 15.24,67.09 J4.P$6 | v14.73,58.93 14.73,57.15 13.46,55.88 13.46,43.43 v14.22,42.67
  Bottom 0.203: U9.4 17.4,31.11 v17.53,31.5 | v15.24,62.48 15.24,59.44 v14.73,58.93 | v14.22,39.12 v14.22,42.67
IO3  (via drill 0.38)
  Top 0.203: U1.P$5 27.3,55.24 27.69,55.63 v33.78,55.63 | v37.59,29.21 20.57,29.21 19.94,27.81 U9.5 19.94,23.28 R4.1 | v40.89,29.97 42.93,29.97 44.45,31.5 44.45,35.81 42.16,38.1 42.16,46.74 | 42.16,46.74 37.59,51.31 v37.59,55.63 | R3.2 55.88,54.36 55.37,54.86 53.59,54.86 53.09,54.36 v53.09,52.32 | v49.02,52.32 47.75,52.32 42.16,46.74
  Bottom 0.203: v33.78,55.63 v37.59,55.63 | v37.59,29.21 40.13,29.21 v40.89,29.97 | v53.09,52.32 v49.02,52.32
IO4  (via drill 0.38)
  Top 0.203: U9.6 22.48,22.73 v21.08,21.34 | v6.86,21.34 6.86,13.72 5.59,12.45 2.19,12.45 J6.P$5
  Bottom 0.203: v21.08,21.34 v6.86,21.34
IO5  (via drill 0.38)
  Top 0.203: v31.5,32.51 31.5,36.58 v29.21,38.86 | v29.21,44.7 28.96,44.96 24.13,44.96 22.61,46.48 21.08,46.48 20.07,47.5 20.07,53.59 v18.29,55.37 | v18.29,58.93 18.29,67.29 J4.P$5
  Bottom 0.203: U9.11 34.29,27.56 34.29,29.46 31.5,32.26 v31.5,32.51 | v29.21,38.86 v29.21,44.7 | v18.29,55.37 v18.29,58.93
IO6  (via drill 0.38)
  Top 0.203: U9.12 37.85,26.54 37.85,24.13 36.07,22.35 v36.07,20.32 | U10.4 29.34,10.54 29.97,11.18 35.56,11.18 36.07,11.68 v36.07,16.26
  Bottom 0.203: v36.07,16.26 v36.07,20.32
IO7  (via drill 0.38)
  Top 0.203: R19.2 5.71,30.86 v6.35,29.97 | v12.19,29.97 38.35,29.97 39.88,28.45 39.88,27.05 U9.13
  Bottom 0.203: v6.35,29.97 v12.19,29.97
IO8  (via drill 0.38)
  Top 0.203: v50.29,23.37 73.41,23.37 79.76,17.02 R5.1 | v46.23,23.37 46.1,23.37 U9.14
  Bottom 0.203: v50.29,23.37 v46.23,23.37
IO9  (via drill 0.38)
  Top 0.203: v46.48,34.29 46.48,41.4 v47.75,42.67 | 82.63,39.12 R6.1 79.25,38.86 76.71,41.4 76.71,44.45 74.17,46.99 56.13,46.99 v53.34,44.2
  Bottom 0.203: v46.48,34.29 U9.15 | v47.75,42.67 51.82,42.67 v53.34,44.2
LAMP_5V  (via drill 0.38)
  Top 0.203: v65.79,5.08 65.79,19.05 62.48,22.35 55.88,22.35 53.85,20.32 48.13,20.32 S1.4
  Top 0.305: S1.6 S1.5 S1.4
  Bottom 0.203: J5.P$3 65.79,4.82 v65.79,5.08
MISO_IO12
  Top 0.203: U9.18 35.18,45.59 35.81,46.23 36.76,46.23 ICSP.1 36.83,46.16 36.83,46.99 35.31,48.51 23.37,48.51 21.34,50.55 21.34,53.59 17.77,57.16 | SD.P$7 17.77,57.16 | 17.77,57.16 17.8,57.16 20.83,60.2 22.61,60.2 23.37,60.96 23.37,62.98 U1.P$19
MOSI_IO11  (via drill 0.38)
  Top 0.203: U9.17 37.72,35.94 | 37.72,35.94 38.61,36.83 40.13,36.83 41.15,37.85 41.15,42.42 40.13,43.43 | 40.13,43.43 39.56,43.43 ICSP.4 | J4.P$3 25.15,67.85 25.15,66.8 26.04,65.91 U1.P$17 26.04,61.85 27.69,60.2 35.05,60.2 36.83,58.42 36.83,50.29 39.62,47.5 40.13,47.5 41.15,46.48 41.15,44.45 40.13,43.43 | U6.5 29.84,40.01 v30.99,38.86 | v37.34,38.35 37.34,36.32 37.72,35.94
  Bottom 0.203: v30.99,38.86 36.83,38.86 v37.34,38.35
N$1
  Top 0.305: T2.3 79.7,42.42 U5.P$2
N$2
  Top 0.305: T1.3 79.7,20.57 U4.P$2
N$3
  Top 0.305: T1.1 84.16,17.27 R5.2
N$4
  Top 0.203: T2.1 84.16,39.11 R6.2
N$5
  Top 0.61: R13.2 R12.1 56.05,38.95 56.64,38.35 56.64,37.22 U5.P$6
N$6  (via drill 0.38)
  Top 0.305: 37.08,64.77 B1.P$1 | U1.P$16 27.3,61.85 27.69,61.47 36.58,61.47 38.1,62.99
  Top 0.61: 38.1,62.48 38.1,62.99 B1.P$1 38.61,64.26 v38.61,65.53 | 53.85,62.48 B1.P$2 49.53,68.07 v42.16,68.07
  Bottom 0.61: v38.61,65.53 41.15,68.07 v42.16,68.07
N$7
  Top 0.508: U3.5 58.74,57.72 58.42,57.4 R7.2
N$8
  Top 0.203: U6.4 28.57,42.55 27.69,43.43 23.37,43.43 22.35,44.45 19.81,44.45 18.29,45.97 18.29,51.56 17.09,52.77 SD.P$3
N$9
  Top 0.203: SD.P$5 17.17,54.97 19.05,53.09 19.05,46.74 20.57,45.21 22.86,45.21 23.88,44.2 27.94,44.2 28.7,43.43 30.48,43.43 31.11,42.8 U6.6
N$10
  Top 0.508: U3.1 63.28,56.16 61.47,54.36 R3.1
N$13
  Top 0.305: U10.1 25.53,6.73 24.89,6.1 24.89,5.46 C25.2
N$14
  Top 0.305: U10.2 26.8,6.73 27.18,6.35 27.18,5.21 C25.1 R22.1
N$15
  Top 0.406: D4.P$1 1.69,34.01 R19.1
N$17
  Top 0.406: R20.1 1.79,42.8 D4.P$4
N$18
  Top 0.406: D4.P$3 3.05,37.11 3.05,40.13 2.96,40.13 R21.1
N$19
  Top 0.406: U8.1 12.06,10.03 10.58,8.55 C16.1
N$20
  Top 0.61: R10.1 R11.2 55.91,16.42 U4.P$6
N$21
  Top 0.406: U8.3 14.61,10.03 13.97,9.4 13.21,9.4 12.45,8.64 12.45,7.79 C16.2
N$22
  Top 0.406: U8.4 15.88,7.83 C17.1
N$23
  Top 0.406: U8.5 17.14,7.83 C17.2
N$24
  Top 0.406: U8.6 18.41,9.95 C19.1
N$26
  Top 0.406: U8.2 13.34,12.83 12.45,13.72 9.82,13.72 C18.2
N$163
  Top 0.203: SD.P$2 17.17,51.66 17.53,51.31 17.53,45.47 19.3,43.69 22.1,43.69 22.86,42.93 25.65,42.93 26.04,42.55 U6.2
RESET
  Top 0.203: U9.1 9.78,29.08 11.43,30.73 35.81,30.73 36.32,31.24 36.32,40.41 ICSP.5 | RESET.4 9.97,5.78 | R17.1 7.87,21.68 7.87,7.87 9.94,5.81 RESET.4 | RESET.4 RESET.3 20.61,5.81 22.86,3.56 32,3.56 33.15,4.7 U10.7
  Top 0.406: R17.1 9.4,23.24 9.4,26.29 U9.1
RX_FROM_SPEC  (via drill 0.38)
  Top 0.406: U8.13 15.88,14.86 v15.75,14.73
  Bottom 0.406: v15.75,14.73 2.59,14.73 J6.P$4
RX_IO0
  Top 0.406: U9.2 12.45,26.54 12.45,25.65 13.21,24.89 13.21,23.11 17.14,19.18 U8.12
SCK_IO13  (via drill 0.38)
  Top 0.203: U9.19 32.38,34.54 U6.7 32.51,41.45 v32.51,43.43 | v35.31,50.55 35.31,58.42 34.54,59.18 26.92,59.18 24.77,61.34 U1.P$18 24.77,64.39 24.38,64.77 22.61,64.77 | U1.P$20 22.23,64.39 22.61,64.77 | 22.61,64.77 22,65.38 22,67.79 J4.P$4
  Bottom 0.203: ICSP.3 35.56,43.54 | 35.56,43.54 32.62,43.54 v32.51,43.43 | v35.31,50.55 35.31,43.79 35.56,43.54
SHUTTER_ENABLE  (via drill 0.38)
  Top 0.203: v58.17,5.08 50.04,5.08 49.02,4.06 46.48,4.06 46.23,4.32 46.23,4.99 R16.2 46.14,9.67 S1.3 | v61.72,5.08 62.99,5.08 64.01,4.06 72.78,4.06 J5.P$6
  Bottom 0.203: v61.72,5.08 v58.17,5.08
TUNGSTEN_ENABLE  (via drill 0.38)
  Top 0.203: S1.2 43.27,10 R15.2 43.43,4.91 43.43,4.32 44.96,2.79 57.66,2.79 v58.42,3.56 | J5.P$5 70.54,3.3 61.47,3.3 v61.21,3.56
  Bottom 0.203: v61.21,3.56 v58.42,3.56
TX_IO1
  Top 0.406: U9.3 14.86,23.5 18.41,19.94 U8.11
TX_TO_SPEC  (via drill 0.38)
  Top 0.406: U8.14 14.61,18.16 v14.99,18.54
  Bottom 0.406: v14.99,18.54 2.29,18.54 J6.P$3
XTAL1
  Top 0.406: U9.9 30.1,24.51 30.48,24.13 30.48,23.37 R18.1 30.61,20.18 Y1.3
XTAL2
  Top 0.406: Y1.1 32.5,23.13 R18.2 32.38,26.42 U9.10

### Text on the board
tPlace: 3.7 V | LEDs | Batt | + - | GND | 48V | 3.3V | 5V | Spec | 12V | UV/VIS Lamp | LEDIF-PEAT v2.0 12/20/13 | S. Senft-Grupp, MIT